# EAGLE design DC-DC Module Board Mk.2 (EAGLE 6.1)

## Sheet 1 of 4
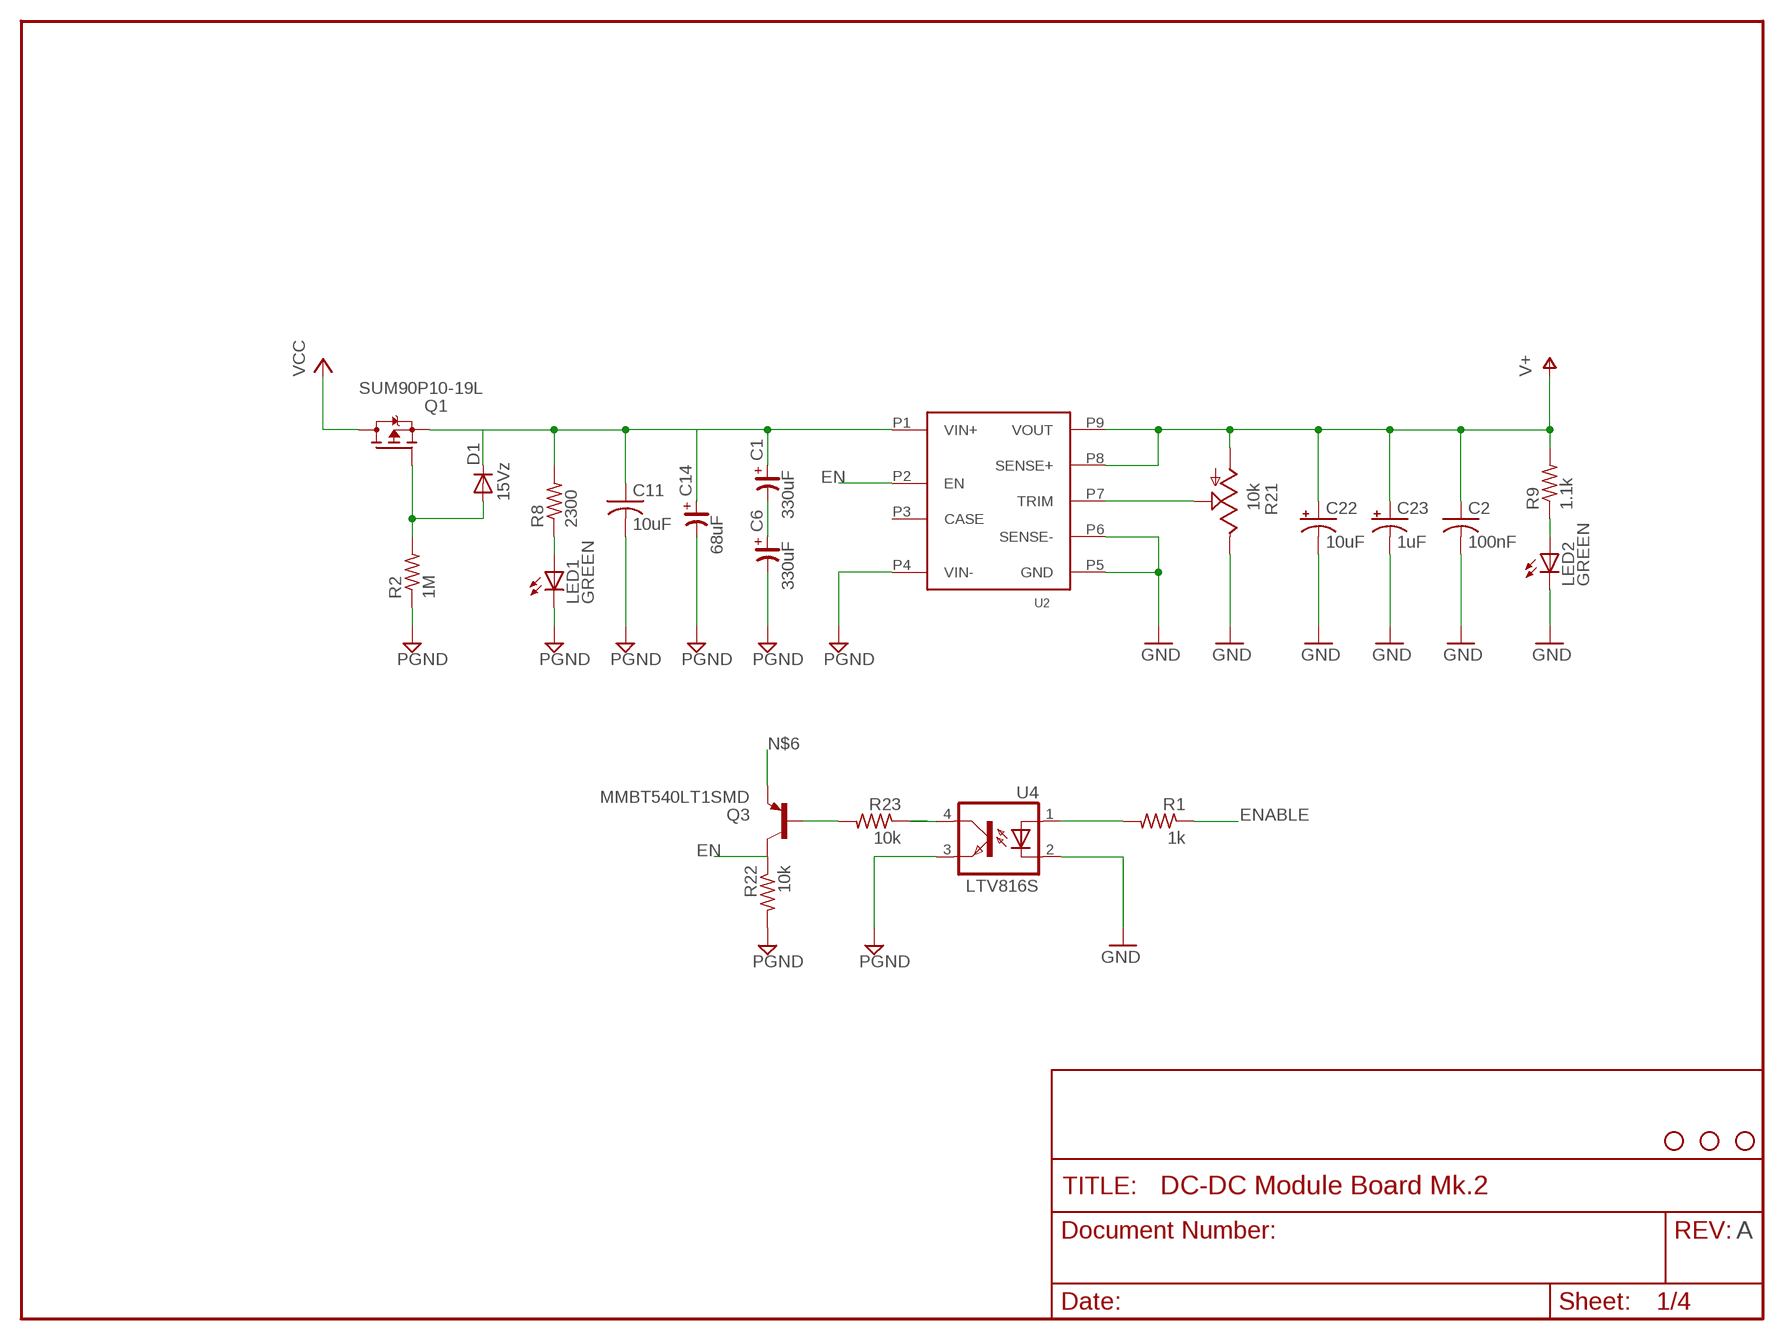
[diagram p0: schematic, sheet 1]

### Parts
C1  330uF  CP_SV-H  [CSV-H]
C2  100nF  C-USC0603  [C0603]
C6  330uF  CP_SV-H  [CSV-H]
C11  10uF  C-USC2220K  [C2220K]
C14  68uF  CP_SV-H  [CSV-H]
C22  10uF  CAP_POL7343  [EIA7343]
C23  1uF  CAP_POL3528  [EIA3528]
D1  15Vz  DIODE-SOD123  [SOD123]
JP1  STAND-OFF  [STAND-OFF]
JP2  STAND-OFF  [STAND-OFF]
JP4  STAND-OFF  [STAND-OFF]
LED1  GREEN  LED0603  [LED-0603]
LED2  GREEN  LED0603  [LED-0603]
Q1  SUM90P10-19L  SPB80P06P  [TO263]
Q3  MMBT540LT1SMD  [SOT23-BEC]
R1  1k  R-US_R0603  [R0603]
R2  1M  R-US_R0603  [R0603]
R8  2300  R-US_R2512  [R2512]
R9  1.1k  R-US_R1206  [R1206]
R21  10k  TRIM_US-SM-42/43W  [SM-42/43W]
R22  10k  R-US_R0603  [R0603]
R23  10k  R-US_R0603  [R0603]
U2  CHB350-24V  [CHB350HALFBRICK]
U4  LTV816S  [SMD4]

### Nets
EN: Q3.C R22.1 U2.P2(EN)
ENABLE: R1.1 ; also sheet 3
GND: C2.2 C22.C(-) C23.C(-) LED2.C R21.3(E) U2.P5(GND) U2.P6(SENSE-) U4.2(C) ; also sheet 2,3,4
GND1: C6.- C11.2 C14.- LED1.C R2.1 R22.2 U2.P4(VIN-) U4.3(EMIT) ; supply symbol labelled PGND ; also sheet 4
N$1: R1.2 U4.1(A)
N$4: C1.- C6.+
N$5: D1.A Q1.1(G) R2.2
N$6: C1.+ C11.1 C14.+ D1.C Q1.2(S) Q3.E R8.2 U2.P1(VIN+)
N$7: LED2.A R9.1
N$9: LED1.A R8.1
N$19: R21.2(S) U2.P7(TRIM)
N$23: R23.1 U4.4(COL)
N$24: Q3.B R23.2
V+: C2.1 C22.A(+) C23.A(+) R9.2 R21.1(A) U2.P8(SENSE+) U2.P9(VOUT) ; also sheet 2
VCC: Q1.3(D) ; also sheet 4
Unconnected: U2.P3(CASE)

### Notes on the sheet
- A

## Sheet 2 of 4
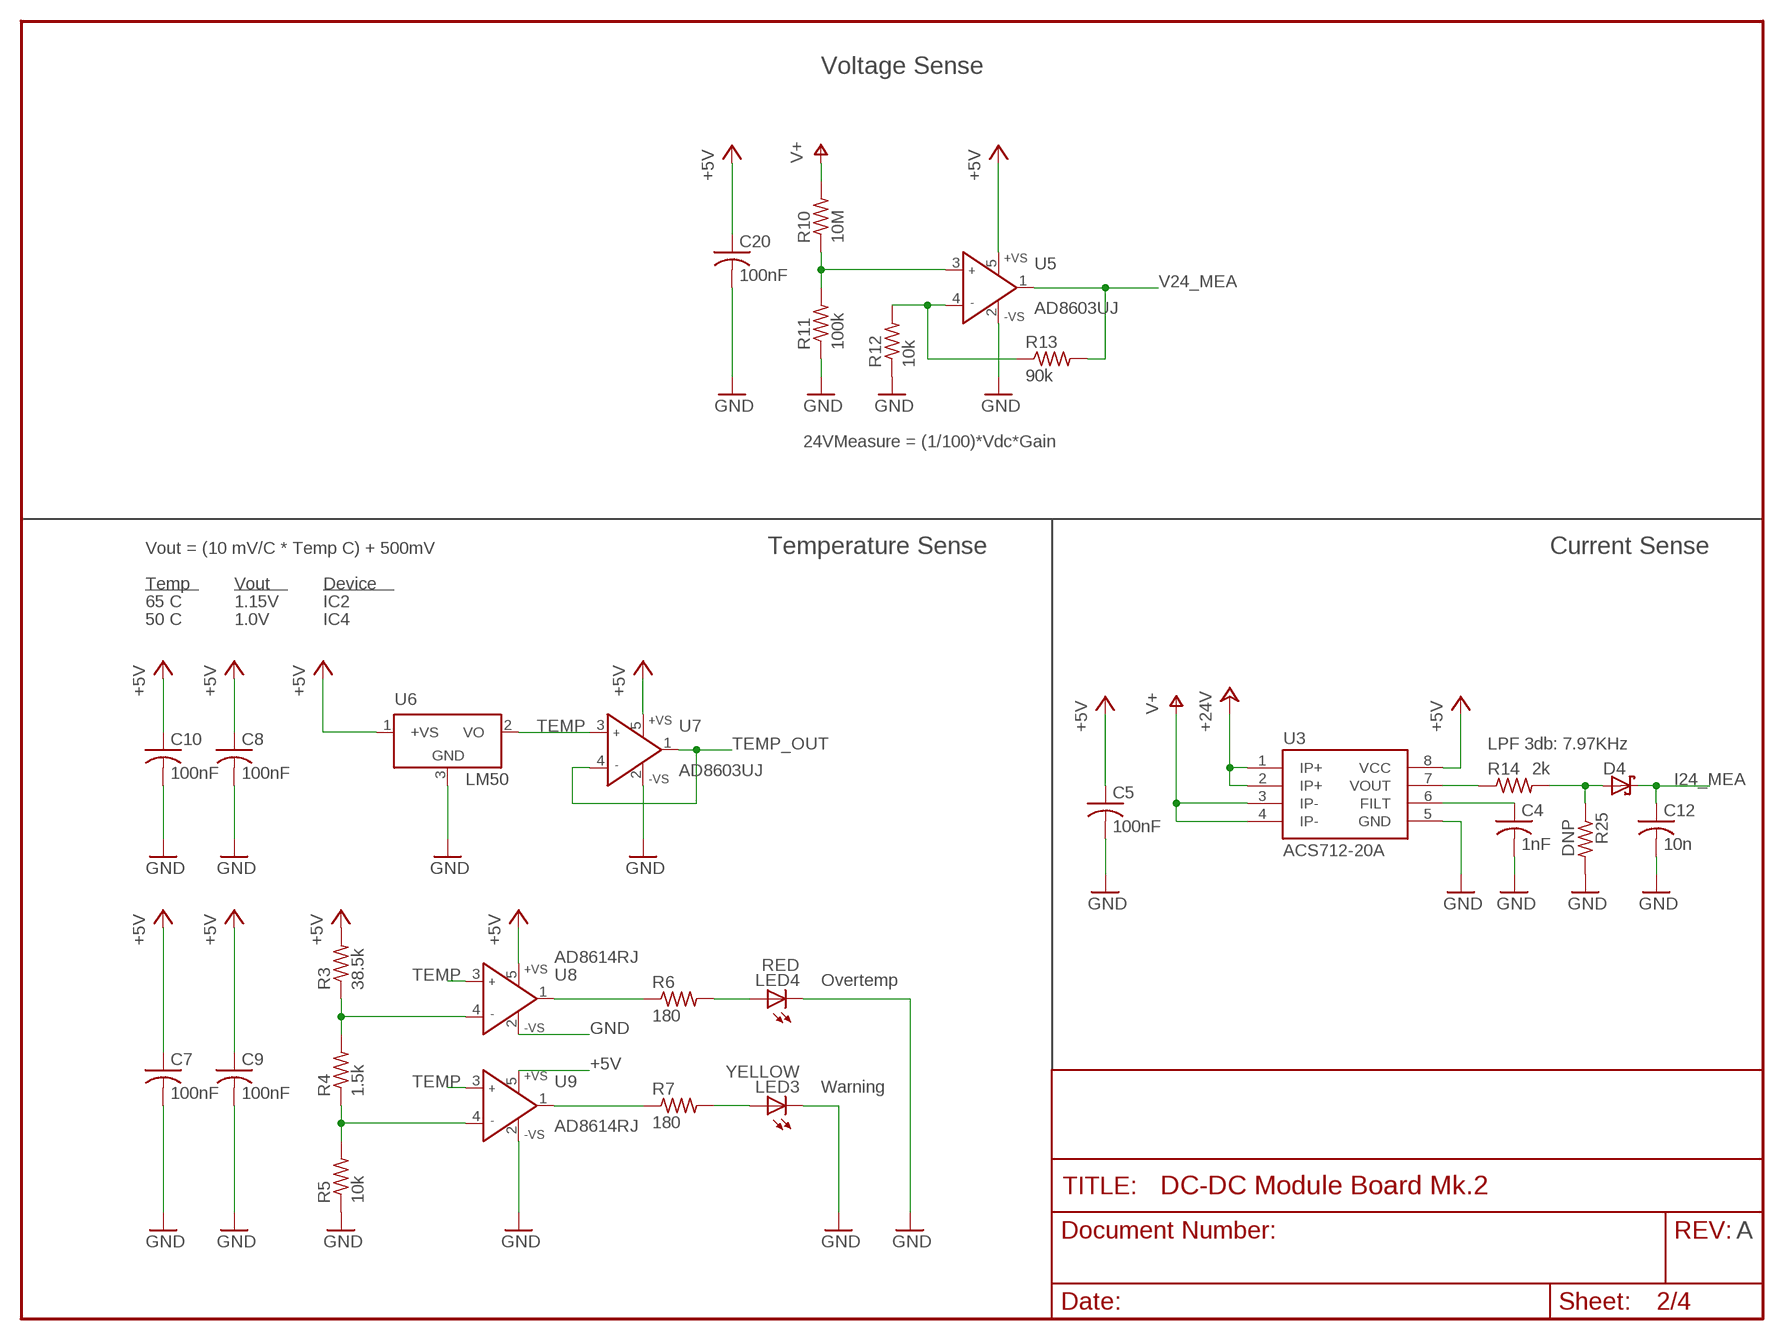
[diagram p1: schematic, sheet 2]

### Parts
C4  1nF  C-USC0603  [C0603]
C5  100nF  C-USC0603  [C0603]
C7  100nF  C-USC0603  [C0603]
C8  100nF  C-USC0603  [C0603]
C9  100nF  C-USC0603  [C0603]
C10  100nF  C-USC0603  [C0603]
C12  10n  C-USC0603  [C0603]
C20  100nF  C-USC0603  [C0603]
D4  BAT54  [SOT23]
LED3  YELLOW  LED0603  [LED-0603]
LED4  RED  LED0603  [LED-0603]
R3  38.5k  R-US_R0603  [R0603]
R4  1.5k  R-US_R0603  [R0603]
R5  10k  R-US_R0603  [R0603]
R6  180  R-US_R0603  [R0603]
R7  180  R-US_R0603  [R0603]
R10  10M  R-US_R0603  [R0603]
R11  100k  R-US_R0603  [R0603]
R12  10k  R-US_R0603  [R0603]
R13  90k  R-US_R0603  [R0603]
R14  2k  R-US_R0603  [R0603]
R25  DNP  R-US_R0603  [R0603]
U3  ACS712-20A  ACS712  [SO08]
U5  AD8603UJ  [SOT23-5]
U6  LM50  [SOT23]
U7  AD8603UJ  [SOT23-5]
U8  AD8614RJ  [SOT23-5]
U9  AD8614RJ  [SOT23-5]

### Nets
+5V: C5.1 C7.1 C8.1 C9.1 C10.1 C20.1 R3.2 U3.8(VCC) U5.5(+VS) U6.1(+VS) U7.5(+VS) U8.5(+VS) U9.5(+VS) ; also sheet 3,4
+24V: U3.1(IP+) U3.2(IP+) ; also sheet 4
GND: C4.2 C5.2 C7.2 C8.2 C9.2 C10.2 C12.2 C20.2 LED3.C LED4.C R5.1 R11.1 R12.1 R25.2 U3.5(GND) U5.2(-VS) U6.3(GND) U7.2(-VS) U8.2(-VS) U9.2(-VS) ; also sheet 1,3,4
I24_MEA: C12.1 D4.3(C) ; also sheet 3
N$2: C4.1 U3.6(FILT)
N$3: R3.1 R4.2 U8.4(IN-)
N$8: R4.1 R5.2 U9.4(IN-)
N$10: LED4.A R6.2
N$11: LED3.A R7.2
N$12: R6.1 U8.1(OUT)
N$13: R7.1 U9.1(OUT)
N$14: R12.2 R13.1 U5.4(IN-)
N$15: R10.1 R11.2 U5.3(IN+)
N$17: D4.1(A) R14.2 R25.1
N$18: R14.1 U3.7(VOUT)
TEMP: U6.2(VO) U7.3(IN+) U8.3(IN+) U9.3(IN+)
TEMP_OUT: U7.1(OUT) U7.4(IN-) ; also sheet 3
V24_MEA: R13.2 U5.1(OUT) ; also sheet 3
V+: R10.2 U3.3(IP-) U3.4(IP-) ; also sheet 1

### Notes on the sheet
- Voltage Sense
- 24VMeasure = (1/100)*Vdc*Gain
- Vout = (10 mV/C * Temp C) + 500mV | Temperature Sense | Current Sense
- Temp | Vout | Device
- 65 C | 1.15V | IC2
- 50 C | 1.0V | IC4
- LPF 3db: 7.97KHz
- Overtemp
- Warning
- A

## Sheet 3 of 4
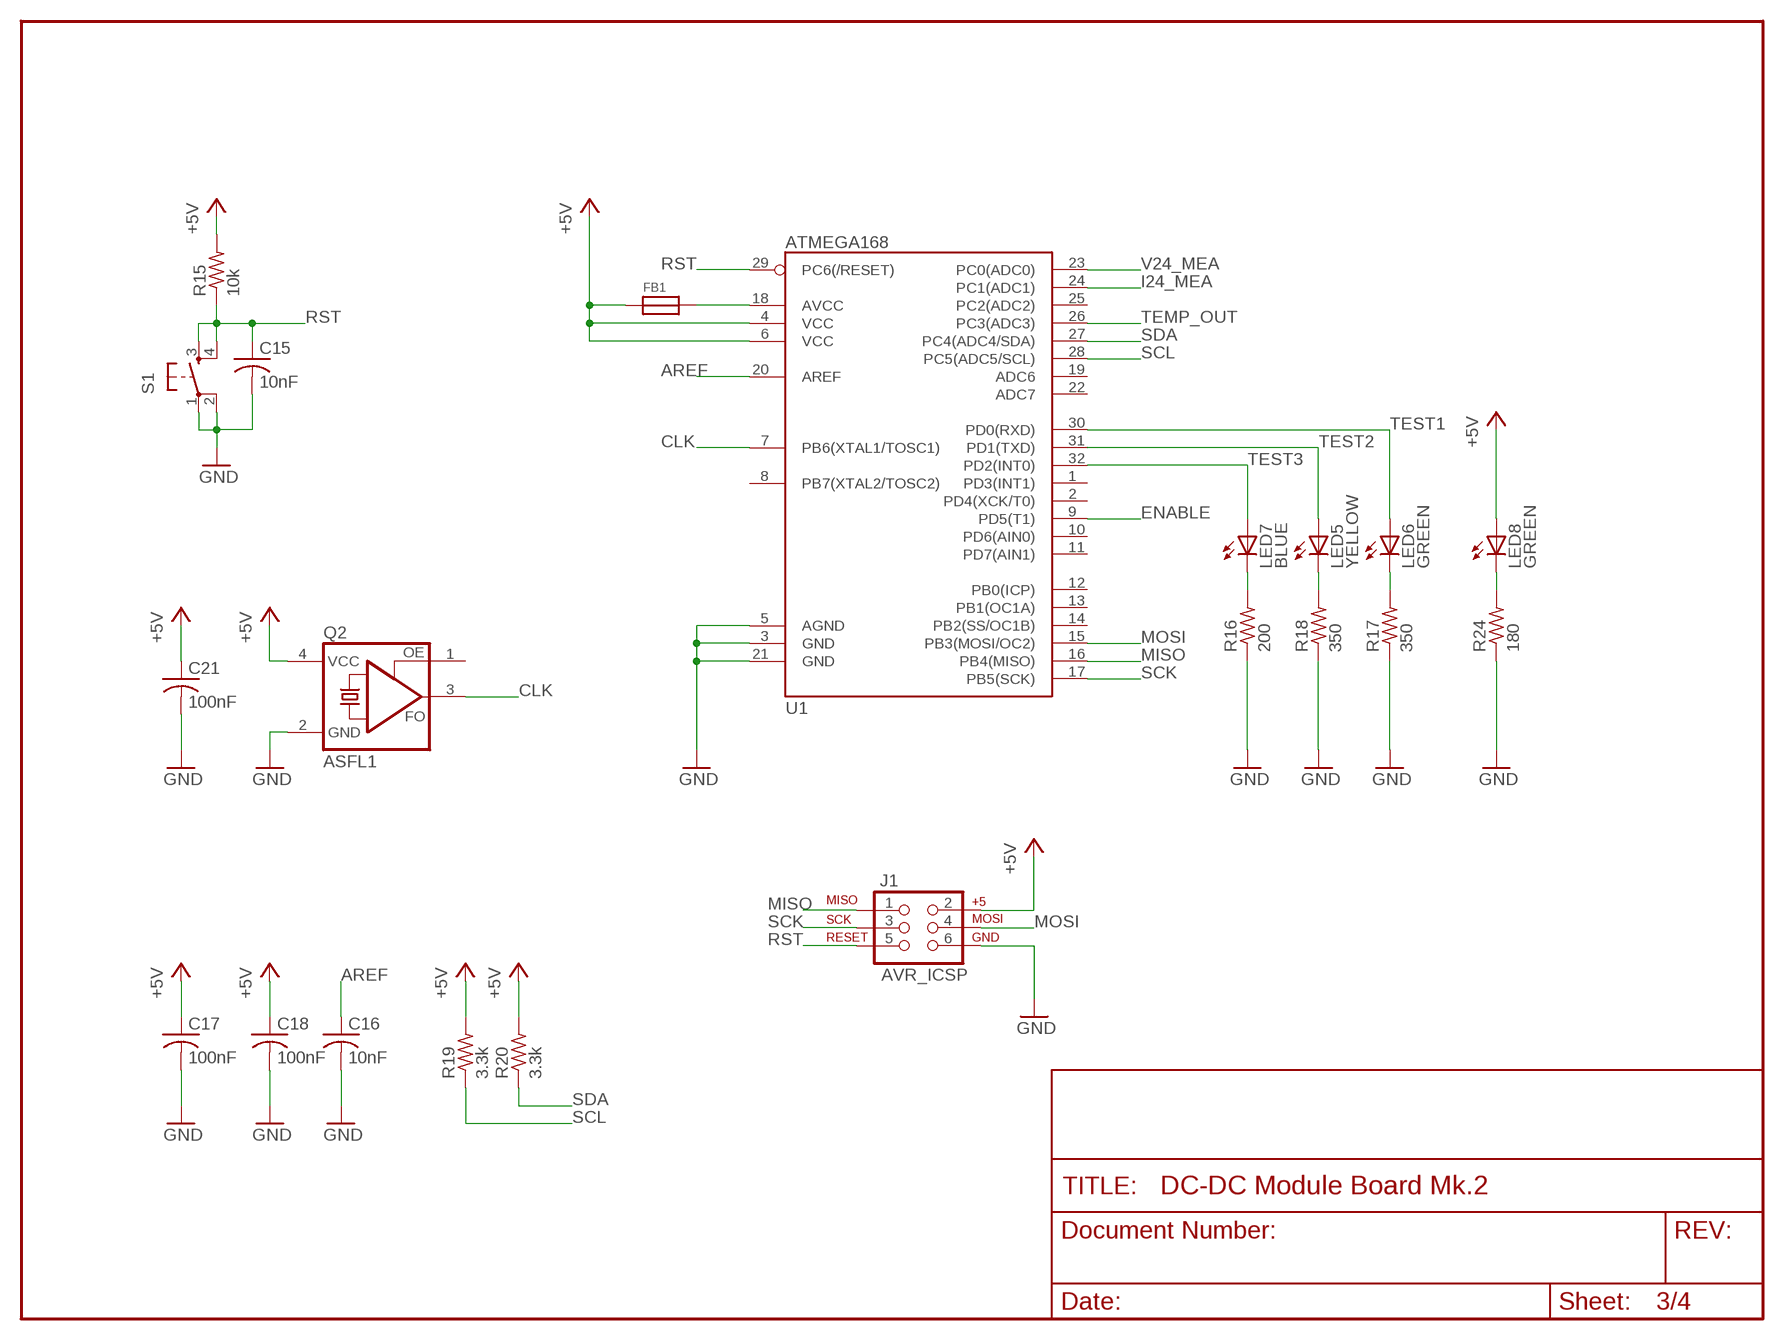
[diagram p2: schematic, sheet 3]

### Parts
C15  10nF  C-USC0603  [C0603]
C16  10nF  C-USC0603  [C0603]
C17  100nF  C-USC0603  [C0603]
C18  100nF  C-USC0603  [C0603]
C21  100nF  C-USC0603  [C0603]
FB1  FERRITE  [0603]
J1  AVR_ICSP  AVR_SPI_PRG_62X3_LOCK  [2X3_LOCK]
LED5  YELLOW  LED0603  [LED-0603]
LED6  GREEN  LED0603  [LED-0603]
LED7  BLUE  LED0603  [LED-0603]
LED8  GREEN  LED0603  [LED-0603]
Q2  ASFL1  [ASF]
R15  10k  R-US_R0603  [R0603]
R16  200  R-US_R0603  [R0603]
R17  350  R-US_R0603  [R0603]
R18  350  R-US_R0603  [R0603]
R19  3.3k  R-US_R0603  [R0603]
R20  3.3k  R-US_R0603  [R0603]
R24  180  R-US_R0603  [R0603]
S1  TAC_SWITCHSMD  [TACTILE_SWITCH_SMD]
U1  ATMEGA168  [TQFP32-08]

### Nets
+5V: C17.1 C18.1 C21.1 FB1.1 J1.2 LED8.A Q2.4(VCC) R15.2 R19.2 R20.2 U1.4(VCC) U1.6(VCC) ; also sheet 2,4
AREF: C16.1 U1.20(AREF)
CLK: Q2.3(FO) U1.7(PB6(XTAL1/TOSC1))
ENABLE: U1.9(PD5(T1)) ; also sheet 1
GND: C15.2 C16.2 C17.2 C18.2 C21.2 J1.6 Q2.2(GND) R16.1 R17.1 R18.1 R24.1 S1.1 S1.2 U1.3(GND) U1.5(AGND) U1.21(GND) ; also sheet 1,2,4
I24_MEA: U1.24(PC1(ADC1)) ; also sheet 2
MISO: J1.1 U1.16(PB4(MISO))
MOSI: J1.4 U1.15(PB3(MOSI/OC2))
N$16: FB1.2 U1.18(AVCC)
N$20: LED7.C R16.2
N$21: LED5.C R18.2
N$22: LED6.C R17.2
N$25: LED8.C R24.2
RST: C15.1 J1.5 R15.1 S1.3 S1.4 U1.29(PC6(/RESET))
SCK: J1.3 U1.17(PB5(SCK))
SCL: R19.1 U1.28(PC5(ADC5/SCL)) ; also sheet 4
SDA: R20.1 U1.27(PC4(ADC4/SDA)) ; also sheet 4
TEMP_OUT: U1.26(PC3(ADC3)) ; also sheet 2
TEST1: LED6.A U1.30(PD0(RXD))
TEST2: LED5.A U1.31(PD1(TXD))
TEST3: LED7.A U1.32(PD2(INT0))
V24_MEA: U1.23(PC0(ADC0)) ; also sheet 2
Unconnected: Q2.1(OE) U1.1(PD3(INT1)) U1.2(PD4(XCK/T0)) U1.8(PB7(XTAL2/TOSC2)) U1.10(PD6(AIN0)) U1.11(PD7(AIN1)) U1.12(PB0(ICP)) U1.13(PB1(OC1A)) U1.14(PB2(SS/OC1B)) U1.19(ADC6) U1.22(ADC7) U1.25(PC2(ADC2))

### Notes on the sheet
- C:/Users/Clayton Kleppinger/Dropbox/IEEE ROV 2012/Electronics/DC-DC Module Board/purdue-logo.bmp

## Sheet 4 of 4
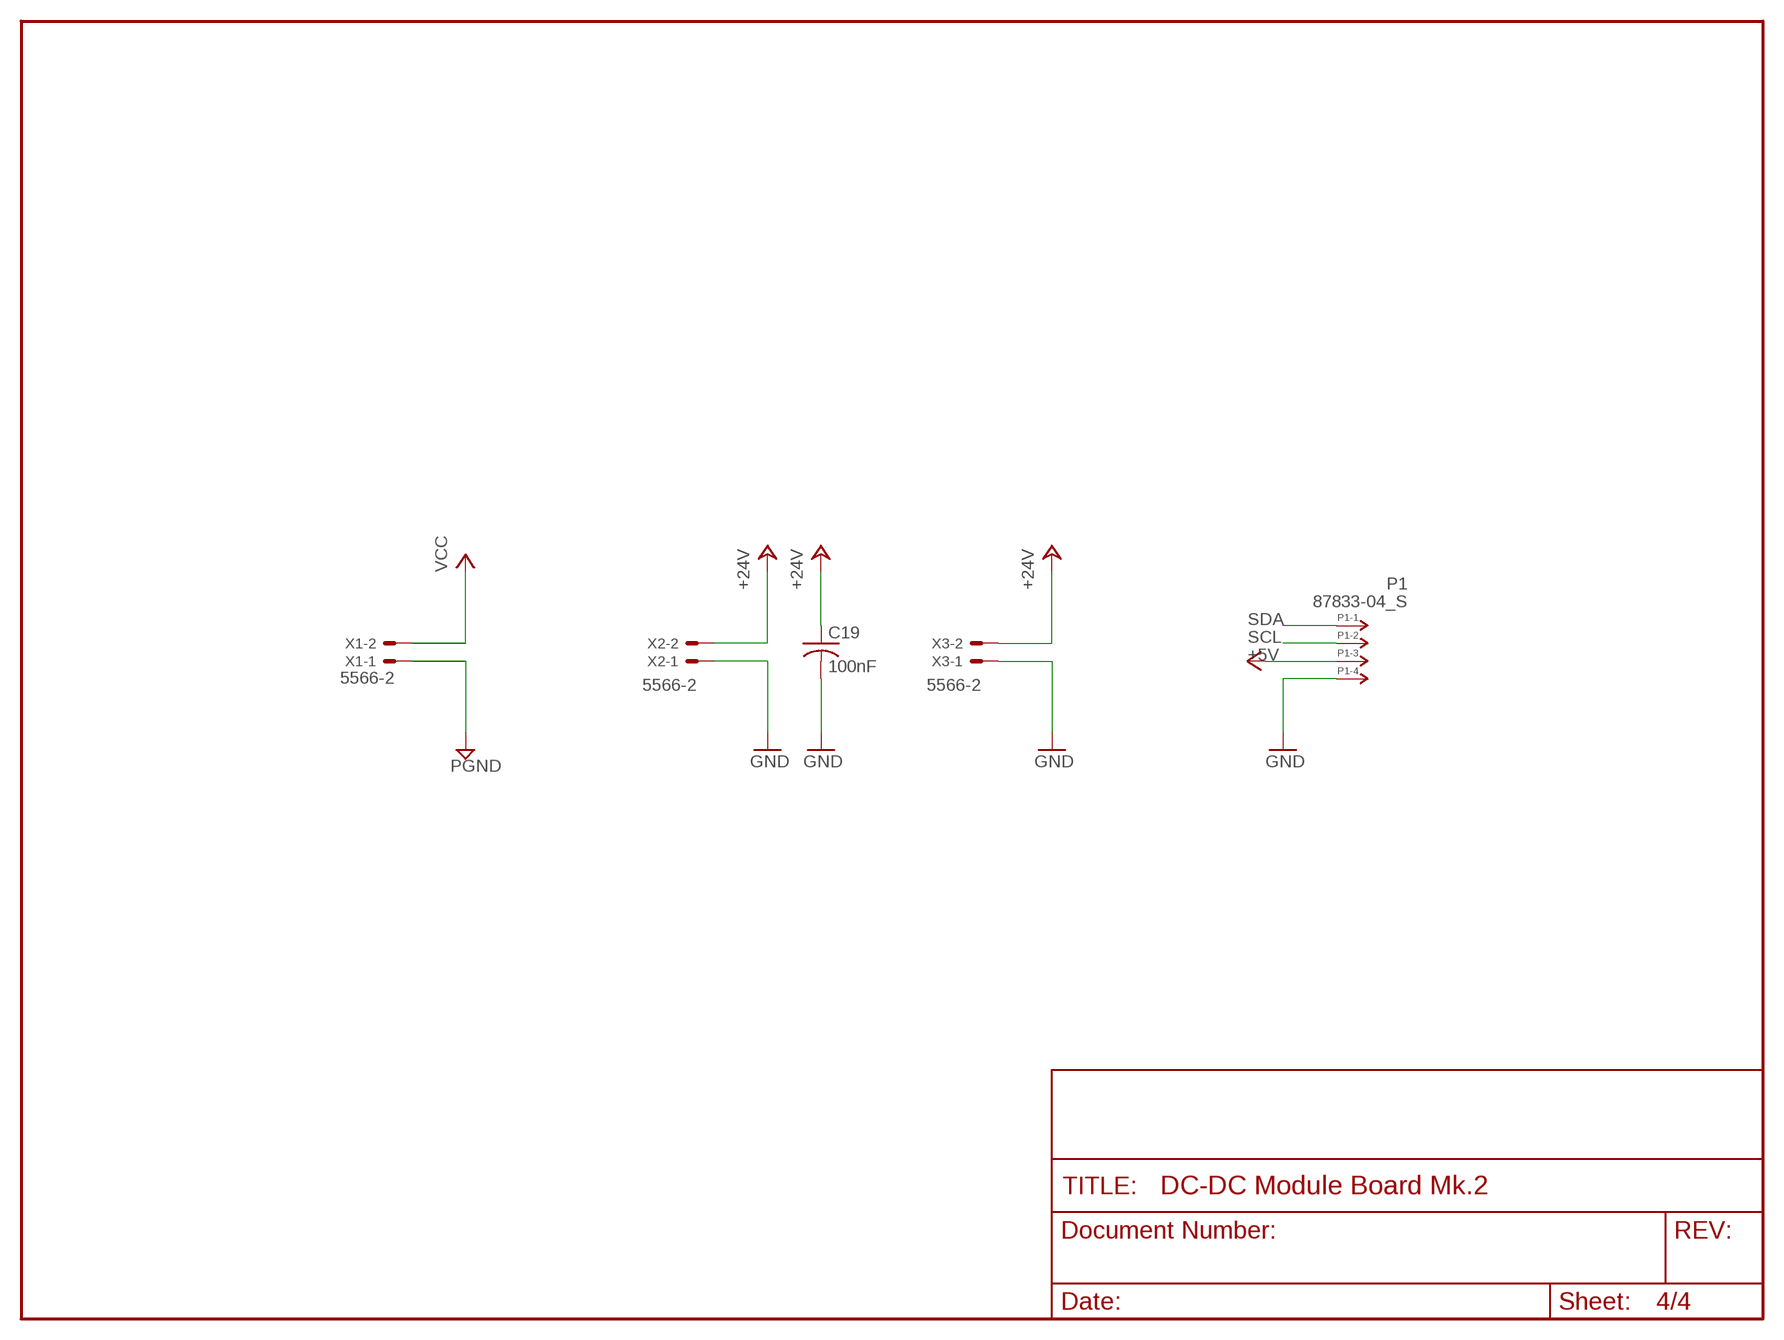
[diagram p3: schematic, sheet 4]

### Parts
C19  100nF  C-USC0603  [C0603]
P1  87833-04_S  [87833-04]
X1  5566-2  [5566-2]
X2  5566-2  [5566-2]
X3  5566-2  [5566-2]

### Nets
+5V: P1.3 ; also sheet 2,3
+24V: C19.1 X2.2 X3.2 ; also sheet 2
GND: C19.2 P1.4 X2.1 X3.1 ; also sheet 1,2,3
GND1: X1.1 ; supply symbol labelled PGND ; also sheet 1
SCL: P1.2 ; also sheet 3
SDA: P1.1 ; also sheet 3
VCC: X1.2 ; also sheet 1

## Library data of the parts
C1 C6 = rc-master:CP_: POLARIZED CAP; BOM: INCLUDE; PARTNO: 338-2190-1-ND
C2 C5 C7-C10 C17-C20 = resistor:C-US: CAPACITOR, American symbol; BOM: INCLUDE; PARTNO: 445-5202-1-ND
C4 = resistor:C-US: CAPACITOR, American symbol; BOM: INCLUDE; PARTNO: 490-1472-1-ND
C11 = resistor:C-US: CAPACITOR, American symbol; BOM: INCLUDE; PARTNO: 445-5212-1-ND
C12 C15 C16 = resistor:C-US: CAPACITOR, American symbol; BOM: INCLUDE; PARTNO: 445-1304-1-ND
C14 = rc-master:CP_: POLARIZED CAP; BOM: INCLUDE; PARTNO: 565-2343-1-ND
C21 = resistor:C-US: CAPACITOR, American symbol; BOM: INCLUDE; PARTNO: 445-5047-1-ND
C22 = SparkFun:CAP_POL: Capacitor Polarized These are standard SMD and PTH capacitors. Normally 10uF, 47uF, and 100uF in electrolytic and tantalum varieties. Always verify the external diameter of the through hole cap, it varies with capacity, voltage, and manufacturer. The EIA devices should be standard.; BOM: INCLUDE; PARTNO: 399-3893-1-ND
C23 = SparkFun:CAP_POL: Capacitor Polarized These are standard SMD and PTH capacitors. Normally 10uF, 47uF, and 100uF in electrolytic and tantalum varieties. Always verify the external diameter of the through hole cap, it varies with capacity, voltage, and manufacturer. The EIA devices should be standard.; BOM: INCLUDE; PARTNO: 478-6247-1-ND
D1 = diode:DIODE-: DIODE; BOM: INCLUDE; PARTNO: MMSZ5245BFSCT-ND
D4 = diode:BAT54: Schottky Diodes Source: Fairchild .. BAT54.pdf; BOM: INCLUDE; PARTNO: BAT54FSCT-ND
FB1 = microbuilder:FERRITE: Ferrite Bead 0603 MMZ1608B121C - 120 Ohm, 600mA Ferrite Chip - Digikey: 445-2164-1-ND BK1608HW121-T - 120 Ohm, 600mA Ferrite Chip - Digikey: 587-1876-2-ND; BOM: INCLUDE; PARTNO: 445-2164-1-ND
J1 = SparkFun:AVR_SPI_PRG_6: AVR ISP 6 Pin This is the reduced ISP connector for AVR programming. Common on Arduino. This footprint will take up less PCB space and can be used with a 10-pin to 6-pin adapter such as SKU: BOB-08508
JP1 JP2 JP4 = SparkFun:STAND-OFF: Stand Off This is the mechanical footprint for a #4 phillips button head screw. Use the keepout ring to avoid running the screw head into surrounding components. SKU : PRT-00447
LED1 LED2 LED6 LED8 = SparkFun:LED: LEDs Standard schematic elements and footprints for 5mm, 3mm, 1206, and 0603 sized LEDs. 5mm - Spark Fun Electronics SKU : COM-00529 (and others); BOM: INCLUDE; PARTNO: 160-1446-1-ND
LED3 = SparkFun:LED: LEDs Standard schematic elements and footprints for 5mm, 3mm, 1206, and 0603 sized LEDs. 5mm - Spark Fun Electronics SKU : COM-00529 (and others); BOM: INCLUDE; PARTNO: 160-1447-1-ND
LED4 LED5 = SparkFun:LED: LEDs Standard schematic elements and footprints for 5mm, 3mm, 1206, and 0603 sized LEDs. 5mm - Spark Fun Electronics SKU : COM-00529 (and others); BOM: INCLUDE; PARTNO: 160-1448-1-ND
LED7 = SparkFun:LED: LEDs Standard schematic elements and footprints for 5mm, 3mm, 1206, and 0603 sized LEDs. 5mm - Spark Fun Electronics SKU : COM-00529 (and others); BOM: INCLUDE; PARTNO: 160-1647-1-ND
P1 = con-molex-milli-grid:87833-04_S: HEADER; BOM: INCLUDE; PARTNO: WM18858-ND
Q1 = transistor-fet:SPB80P06P: SIPMOS (R) Power-Transistor P-Channel, Enhancement mode Source: http://www.infineon.com/upload/Document/cmc_upload/documents/011/3685/SPP80P06P.pdf; BOM: INCLUDE; PARTNO: SUM90P10-19L-E3CT-ND
Q2 = crystal:ASF*: CRYSTAL CLOCK OSCILLATORS 5.0 Vdc or 3.3 Vdc - LOW PROFILE ULTRA MINIATURE CERAMIC SURFACE MOUNT Source: http://www.abracon.com/Oscillators/asf1-L-L1.pdf; BOM: INCLUDE; MF: Abracon Corporation; MPN: ASFL1-125.000MHZ-EC-T; OC_FARNELL: 1838931; OC_NEWARK: 19M1882; PARTNO: XC1900CT-ND
Q3 = transistor-pnp:MMBT540*: PNP Transistror; BOM: INCLUDE; PARTNO: MMBT5401FSCT-ND
R1 = resistor:R-US_: RESISTOR, American symbol; BOM: INCLUDE; PARTNO: P1.00KHCT-ND
R2 = resistor:R-US_: RESISTOR, American symbol; BOM: INCLUDE; PARTNO: 1.00MHCT-ND
R3 = resistor:R-US_: RESISTOR, American symbol; BOM: INCLUDE; PARTNO: P33.2KHCT-ND
R4 = resistor:R-US_: RESISTOR, American symbol; BOM: INCLUDE; PARTNO: P2.70KHCT-ND
R5 R12 R15 R22 R23 = resistor:R-US_: RESISTOR, American symbol; BOM: INCLUDE; PARTNO: P10.0KHCT-ND
R6 R7 = resistor:R-US_: RESISTOR, American symbol; BOM: INCLUDE; PARTNO: P82.0HCT-ND
R8 = resistor:R-US_: RESISTOR, American symbol; BOM: INCLUDE; PARTNO: RHC2512FT2K20CT-ND
R9 = resistor:R-US_: RESISTOR, American symbol; BOM: INCLUDE; PARTNO: RNCP1206FTD1K10CT-ND
R10 = resistor:R-US_: RESISTOR, American symbol; BOM: INCLUDE; PARTNO: P10MGCT-ND
R11 = resistor:R-US_: RESISTOR, American symbol; BOM: INCLUDE; PARTNO: P100KHCT-ND
R13 = resistor:R-US_: RESISTOR, American symbol; BOM: INCLUDE; PARTNO: P90.9KHCT-ND
R14 R25 = resistor:R-US_: RESISTOR, American symbol; BOM: INCLUDE; PARTNO: P2.00KHCT-ND
R16 = resistor:R-US_: RESISTOR, American symbol; BOM: INCLUDE; PARTNO: P200HCT-ND
R17 R18 = resistor:R-US_: RESISTOR, American symbol; BOM: INCLUDE; PARTNO: P340HCT-ND
R19 R20 = resistor:R-US_: RESISTOR, American symbol; BOM: INCLUDE; PARTNO: P33.0KHCT-ND
R21 = pot:TRIM_US-: POTENTIOMETER; BOM: INCLUDE; PARTNO: SM-43TW103CT-ND
R24 = resistor:R-US_: RESISTOR, American symbol; BOM: INCLUDE; PARTNO: P180HCT-ND
S1 = SparkFun:TAC_SWITCH: Momentary Switch Button commonly used for reset or general input. Spark Fun Electronics SKU : COM-00097; BOM: INCLUDE; PARTNO: COM-08720
U1 = SparkFun:ATMEGA168; BOM: INCLUDE; PARTNO: ATMEGA168-20AU-ND
U2 = Custom_Components:CHB350-24V
U3 = SparkFun:ACS712; BOM: INCLUDE; PARTNO: 620-1190-1-ND
U4 = optocoupler:LTV816: OPTO COUPLER Source: LITEON, LTV816.pdf; BOM: INCLUDE; OC_FARNELL: unknown; OC_NEWARK: unknown; PARTNO: 160-1361-5-ND
U5 U7 = analog-devices:AD8603: Precision Micropower, Low Noise CMOS, Rail-to-Rail Input/Output Operational Amplifiers Source: http://www.analog.com/static/imported-files/data_sheets/AD8603_8607_8609.pdf; BOM: INCLUDE; MF: ALTERA CORPORATION; MPN: AD8603AUJZ-REEL7; OC_FARNELL: 1651290; OC_NEWARK: 59K6904; PARTNO: AD8603AUJZREEL7CT-ND
U6 = linear:LM50: SOT-23 Single-Supply Centigrade Temperature Sensor Vout = (10mV/°C x Temp °C) +5mmmV Source: http://cache.national.com/ds/LM/LM50.pdf; BOM: INCLUDE; PARTNO: LM50CIM3CT-ND
U8 U9 = analog-devices:AD8614: Single and Quad 18 V Operational Amplifiers Source: http://www.analog.com/static/imported-files/data_sheets/AD8614_8644.pdf; BOM: INCLUDE; MF: ALTERA CORPORATION; MPN: AD8614ARTZ-REEL7; OC_FARNELL: 1464998; OC_NEWARK: 88H0303; PARTNO: AD8614ARTZ-REEL7CT-ND
X1-X3 = con-molex:5566-2: Mini FIT connector 2 pol Source: http://www.molex.com; BOM: INCLUDE; OC_FARNELL: 1822072; OC_NEWARK: unknown; PARTNO: WM23800-ND

## Board
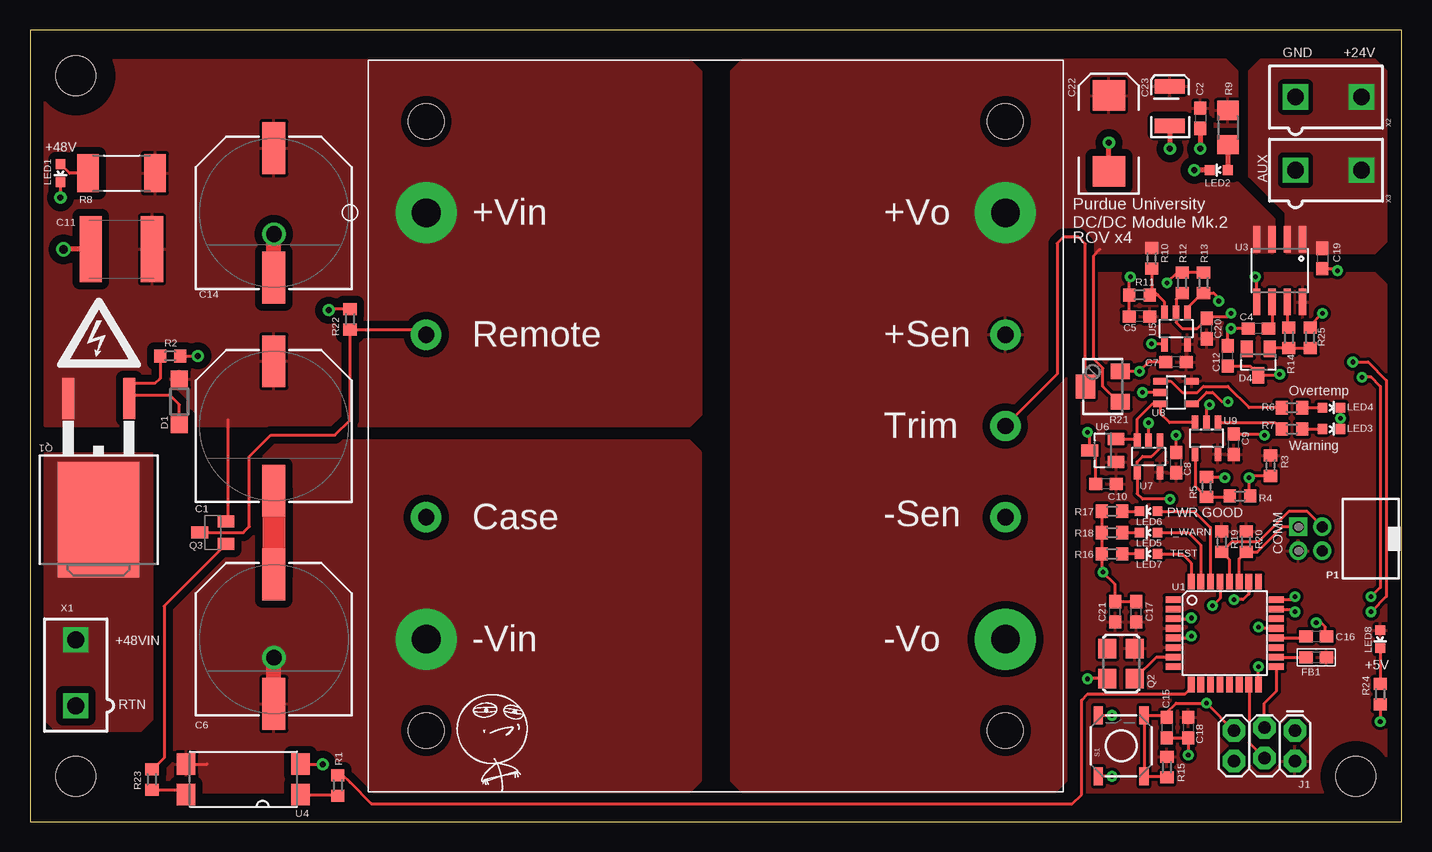
[diagram p4: board, top side]
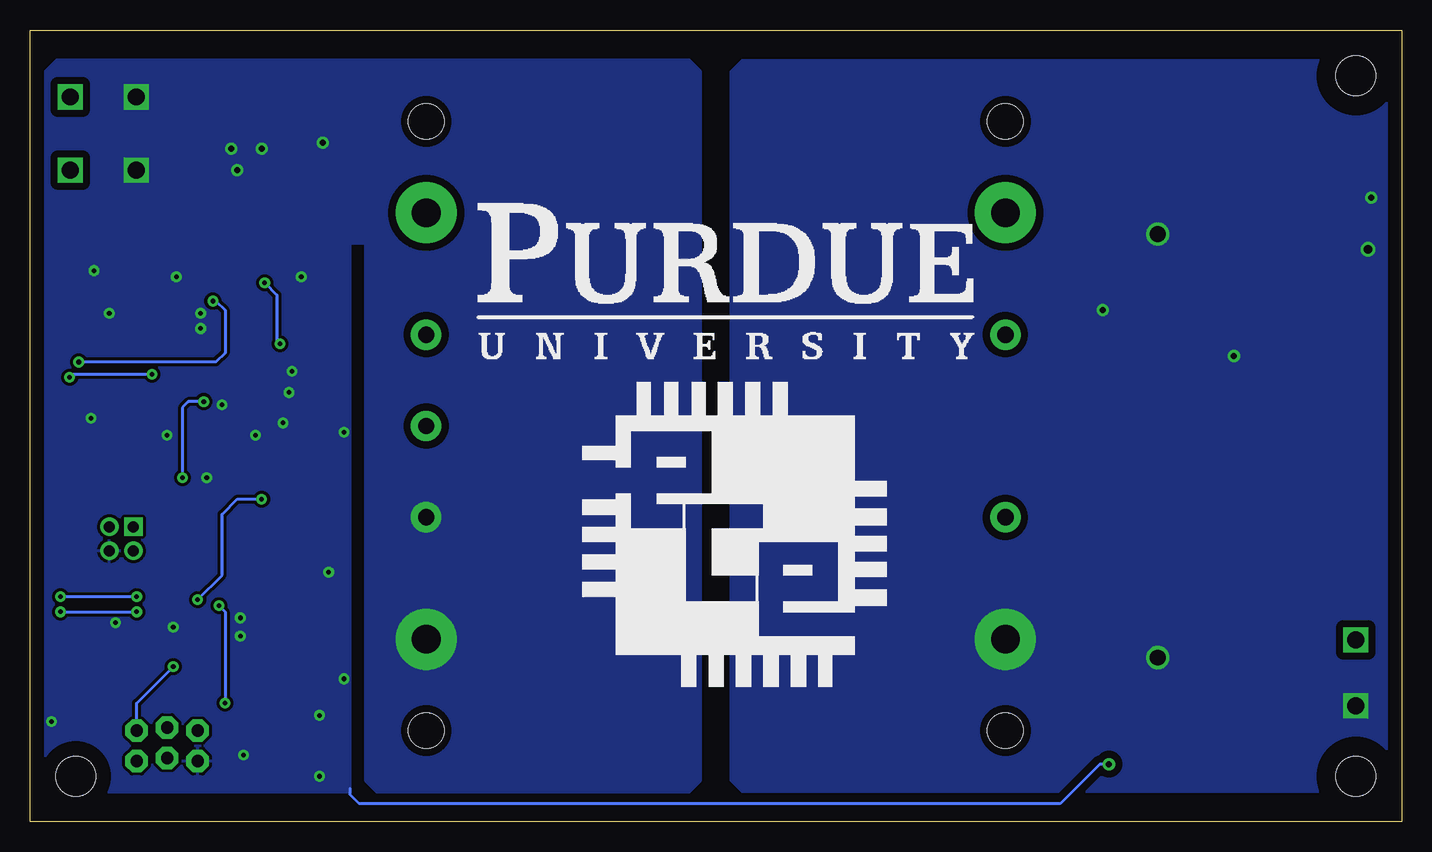
[diagram p5: board, bottom side, seen from below]

Size 114.3 x 66.04 mm. Coordinates in mm from the lower left corner, seen from the top.
Outline: 0,0 114.3,0 114.3,66.04 0,66.04 0,0
Copper layers (1*16): Top 0.035mm / dielectric 1.5mm / Bottom 0.035mm
Design rules: minimum track width 8mil, minimum drill 20mil, track to track 8mil, track to pad 8mil, pad to pad 8mil, via to via 8mil, smd to smd 8mil, copper to edge 10mil, drill to drill 8mil, minimum pad ring 12mil, minimum via ring 10mil, stop-mask expansion 4mil, vias tented up to drill 25mil, thermal gap 10mil
tRestrict: area 1.3,1.3 to 6.3,6.3; area 1.3,59.7 to 6.3,64.8; area 107.9,1.3 to 113,6.3
bRestrict: area 1.3,1.3 to 6.3,6.3; area 1.3,59.7 to 6.3,64.8; area 107.9,1.3 to 113,6.3

### Footprints (pad centres in the part's own frame; a part is rotated, then mirrored left to right if it is on the bottom)
CSV-H = smd 4.318 x 1.93: + -5.397,0; - 5.397,0
C0603 = smd 1.1 x 1: 1 -0.85,0; 2 0.85,0
C2220K = smd 1.85 x 5.5: 1 -2.55,0; 2 2.55,0
EIA7343 = smd 2.55 x 2.7: A 3.17,0; C -3.17,0
EIA3528 = smd 1.2 x 2.5: A 1.65,0; C -1.65,0
SOD123 = smd 1.4 x 1.4: A 1.9,0; C -1.9,0
SOT23 = smd 1 x 1.4: 1 -0.95,-1.1; 2 0.95,-1.1; 3 0,1.1
0603 = smd 1.1 x 1: 1 -0.85,0; 2 0.85,0
2X3_LOCK = drill 1.016 pad 1.88 octagon: 1 0,0; 2 0,2.54; 3 2.54,-0.254; 4 2.54,2.286; 5 5.08,0; 6 5.08,2.54
STAND-OFF = hole 3.302: 0,0
LED-0603 = smd 0.8 x 0.8: A 0,-0.75; C 0,0.75
87833-04 = drill 0.914 square: 1 -1,-1 | drill 0.914: 2 -1,1; 3 1,-1; 4 1,1
TO263 = smd 1 x 3.4: 1 -2.54,-6.6; 2 2.54,-6.6 | smd 6.8 x 9.6: 3 0,3.5
ASF = smd 1.6 x 1.5: 1 -1.25,-1.15; 2 1.25,-1.15; 3 1.25,1.15; 4 -1.25,1.15
SOT23-BEC = smd 1 x 1.4: B -0.95,-1.1; C 0,1.1; E 0.95,-1.1
R0603 = smd 1 x 1.1: 1 -0.85,0; 2 0.85,0
R2512 = smd 1.8 x 3.2: 1 -2.8,0; 2 2.8,0
R1206 = smd 1.6 x 1.803: 1 -1.422,0; 2 1.422,0
SM-42/43W = smd 1.3 x 1.6: 1 -1.27,-1.45; 3 1.27,-1.45 | smd 2 x 1.6: 2 0,1.45
TACTILE_SWITCH_SMD = smd 1.524 x 0.762: 1 -2.54,1.905; 2 2.54,1.905; 3 -2.54,-1.905; 4 2.54,-1.905
TQFP32-08 = smd 1.27 x 0.559: 1 -4.293,2.8; 2 -4.293,2; 3 -4.293,1.2; 4 -4.293,0.4; 5 -4.293,-0.4; 6 -4.293,-1.2; 7 -4.293,-2; 8 -4.293,-2.8; 17 4.293,-2.8; 18 4.293,-2; 19 4.293,-1.2; 20 4.293,-0.4; 21 4.293,0.4; 22 4.293,1.2; 23 4.293,2; 24 4.293,2.8 | smd 0.559 x 1.27: 9 -2.8,-4.293; 10 -2,-4.293; 11 -1.2,-4.293; 12 -0.4,-4.293; 13 0.4,-4.293; 14 1.2,-4.293; 15 2,-4.293; 16 2.8,-4.293; 25 2.8,4.293; 26 2,4.293; 27 1.2,4.293; 28 0.4,4.293; 29 -0.4,4.293; 30 -1.2,4.293; 31 -2,4.293; 32 -2.8,4.293
CHB350HALFBRICK = drill 2.388 pad 5.08: P1 -24.13,17.78; P4 -24.13,-17.78; P5 24.13,-17.78; P9 24.13,17.78 | drill 1.372 pad 2.54: P2 -24.13,7.62; P3 -24.13,-7.62; P6 24.13,-7.62; P7 24.13,0; P8 24.13,7.62 | hole 2.972: -24.13,-25.4; -24.13,25.4; 24.13,25.4; 24.13,-25.4
SO08 = smd 0.61 x 2.21: 1 -1.905,-2.616; 2 -0.635,-2.616; 3 0.635,-2.616; 4 1.905,-2.616; 5 1.905,2.616; 6 0.635,2.616; 7 -0.635,2.616; 8 -1.905,2.616
SMD4 = smd 1.78 x 1.55: 1 -1.27,-4.77; 2 1.27,-4.77; 3 1.27,4.77; 4 -1.27,4.77
SOT23-5 = smd 0.55 x 1.2: 1 -0.95,-1.3; 2 0,-1.3; 3 0.95,-1.3; 4 0.95,1.3; 5 -0.95,1.3
5566-2 = drill 1.4 square: 1 0,-2.75; 2 0,2.75

### Placement (x,y rotation side)
C1  20.32,33.02 270 top
C2  97.54,58.67 270 top
C4  102.36,41.15 180 top
C5  92.46,42.16 180 top
C6  20.32,15.24 270 top
C7  95.5,38.35 180 top
C8  95.5,29.97 90 top
C9  100.33,31.5 90 top
C10  89.66,28.19 180 top
C11  7.62,47.75 180 top
C12  99.82,38.86 90 top
C14  20.32,50.8 270 top
C15  94.74,7.87 270 top
C16  107.19,15.49 0 top
C17  92.2,17.53 90 top
C18  96.52,7.87 270 top
C19  107.7,46.99 270 top
C20  98.04,41.15 90 top
C21  90.42,17.53 90 top
C22  89.92,57.4 90 top
C23  95,59.69 90 top
D1  12.45,35.05 270 top
D4  102.36,38.35 180 top
FB1  107.19,13.72 180 top
J1  105.41,7.62 180 top
JP1  3.81,3.81 0 top
JP2  3.81,62.23 0 top
JP4  110.49,3.81 180 top
LED1  2.54,54.1 180 top
LED2  99.06,54.36 90 top
LED3  108.46,32.77 270 top
LED4  108.46,34.54 270 top
LED5  93.22,24.13 90 top
LED6  93.22,25.91 90 top
LED7  93.22,22.35 90 top
LED8  112.52,15.24 180 top
P1  106.68,23.62 270 top
Q1  5.71,28.7 180 top
Q2  90.93,13.21 270 top
Q3  15.24,24.13 90 top
R1  25.65,3.05 270 top
R2  11.68,38.86 180 top
R3  103.38,29.72 90 top
R4  100.84,27.18 0 top
R5  98.04,27.94 270 top
R6  105.16,34.54 0 top
R7  105.16,32.77 0 top
R8  7.62,54.1 0 top
R9  99.82,57.91 90 top
R10  93.47,46.99 90 top
R11  92.46,43.94 0 top
R12  96.01,44.96 90 top
R13  97.79,44.96 270 top
R14  104.9,40.39 270 top
R15  94.74,4.57 90 top
R16  90.17,22.35 0 top
R17  90.17,25.91 0 top
R18  90.17,24.13 0 top
R19  99.31,23.37 90 top
R20  101.35,23.37 90 top
R21  89.41,36.32 90 top
R22  26.67,41.91 90 top
R23  10.16,3.56 90 top
R24  112.52,10.67 90 top
R25  106.68,40.39 90 top
S1  90.93,6.35 90 top
U1  99.57,15.75 0 top
U2  57.15,33.02 0 top
U3  104.14,45.97 180 top
U4  17.78,3.56 90 top
U5  95.5,41.15 180 top
U6  89.41,30.99 90 top
U7  93.22,30.48 180 top
U8  95.5,35.81 270 top
U9  98.04,32 180 top
X1  3.81,12.45 0 top
X2  108.2,60.45 270 top
X3  108.2,54.36 270 top

### Tracks (layer width: path | path; a pad name or v marks a point on that pad's centre or on a via)
+5V
  pour Top (isolate 0.254): 113.03,2.54 113.03,44.8 112.11,45.72 87.63,45.72 87.63,2.54
+24V
  pour Top (isolate 0.406, no thermals): 104.65,47.5 112.11,47.5 113.03,48.41 113.03,62.58 112.11,63.5 102.52,63.5 101.6,62.58 101.6,53.85 104.65,50.8
AREF
  Top 0.254: U1.20 106.19,15.35 C16.1
CLK
  Top 0.254: U1.7 93.87,13.75 Q2.3
EN
  Top 0.254: Q3.C 17.78,24.13 18.29,24.64 18.29,30.48 20.07,32.26 25.4,32.26 26.67,33.53 R22.1 32.6,41.06 U2.P2
ENABLE
  Top 0.25: 26.67,3.3 26.07,3.9 R1.1
  Top 0.254: 26.67,3.3 28.45,1.52 86.87,1.52 87.63,2.29 87.63,10.16 88.14,10.67 96.27,10.67 96.77,11.18 96.77,11.44 U1.9
GND  (via drill 0.38, 0.5)
  Top 0.254: C4.2 v100.08,41.15 99.82,40.89 C12.2 | 101.73,41.39 C4.2 | U4.2 v24.38,4.83 | R12.1 95.5,43.6 U5.2 95.5,41.66 96.01,41.15 97.28,41.15 98.04,41.91 C20.2 98.19,42.16 99.82,42.16 v100.08,42.42 | 101.22,41.44 C4.2 | 107.7,46.23 C19.2 108.8,46.14 v108.97,45.97 | U1.21 102.47,16.15 v102.36,16.26 | U1.3 96.7,16.95 v96.77,17.02 | U1.5 96.63,15.35 v96.77,15.49 | v90.17,3.81 S1.1 | U3.5 102.23,45.34 v102.11,45.47 | R21.3 v92.46,37.59 93.22,38.35 C7.2 | R25.2 106.68,41.4 v107.7,42.42 | v88.14,32.51 88.31,32.34 U6.3 88.65,30.99 88.81,30.82 C10.2 | S1.2 v90.17,8.89 | C15.2 C18.2 v96.52,5.59 | v89.42,20.84 v89.41,20.83 | R17.1 R18.1 R16.1 89.32,20.92 v89.41,20.83 | U7.2 v93.22,33.27 | C5.2 R11.1 91.61,45.38 v91.69,45.47 | C8.2 v95.5,32.26 | U8.2 v92.71,35.81 | R5.1 99.48,28.79 v99.57,28.7 | U9.2 98.04,34.54 v98.3,34.8 | C9.2 102.78,32.35 v102.87,32.26 | LED4.C 109.21,33.67 v109.22,33.66 109.21,33.64 LED3.C | R24.1 v112.52,8.38 | 107.95,15.49 C16.2 108.08,15.53 108.08,15.75 107.95,15.88 107.95,16.26 107.57,16.64 v107.19,16.64 | Q2.2 88.16,11.96 v88.14,11.94 | v89.41,20.83 90.42,19.81 C21.2 C17.2
  Top 0.406: C22.C v89.92,56.64 | C23.C v95,56.13 | C2.2 v97.54,56.13 | LED2.C v97.03,54.36
  Bottom 0.25: 24.64,4.83 25.15,4.83 25.65,4.32
  Bottom 0.254: v24.38,4.83 24.64,4.83 | 25.65,4.32 28.45,1.52 86.87,1.52 87.63,2.29 87.63,2.79
  pour Bottom (isolate 0.61, no thermals): 86.36,48.26 86.36,3.46 85.44,2.54 59.34,2.54 58.42,3.46 58.42,62.58 59.34,63.5 112.11,63.5 113.03,62.58 113.03,48.26
  pour Bottom (isolate 0.254): 87.63,48.26 113.03,48.26 113.03,2.54 87.63,2.54
GND1  (via drill 0.5, 0.7, 1.3)
  Top 0.254: R2.1 v13.97,38.86 | LED1.C v2.54,52.07 | U4.3 14.73,4.83 | R22.2 24.98,42.76 v24.89,42.67
  Top 0.406: C11.2 v2.79,47.75
  Top 1.27: C14.- v20.32,49.02 | C6.- v20.32,13.72
  pour Bottom (isolate 0.61, rank 2, no thermals): 1.27,2.54 54.96,2.54 55.88,3.46 55.88,62.58 54.96,63.5 1.27,63.5
  pour Top (isolate 0.61): 11.43,2.54 54.96,2.54 55.88,3.46 55.88,30.83 54.96,31.75 11.43,31.75 11.43,29.21
I24_MEA  (via drill 0.38)
  Top 0.254: 102.36,37.34 D4.3 | D4.3 102.27,37.25 102.36,37.34 | D4.3 102.45,37.34 | D4.3 104.06,37.25 v104.14,37.34 | v111.76,18.8 112.52,19.56 112.52,36.32 111.76,37.08 v111,37.08 | U1.24 105.16,18.55 v105.41,18.8 | C12.1 101.69,38.01 102.36,37.34
  Bottom 0.254: v111.76,18.8 v105.41,18.8 | v111,37.08 110.74,37.34 v104.14,37.34
MISO  (via drill 0.38)
  Top 0.254: U1.16 v102.37,12.95 v102.36,12.95
  Bottom 0.254: J1.1 105.41,9.91 v102.36,12.95
MOSI
  Top 0.254: J1.4 101.6,6.6 101.6,11.42 U1.15
N$1
  Top 0.25: U4.1 25.65,2.29 R1.2
N$2
  Top 0.254: U3.6 103.5,41.44 C4.1
N$3  (via drill 0.38)
  Top 0.254: U8.4 97.09,34.86 98.04,35.81 98.55,35.81 99.31,35.05 v99.82,35.05 | R4.2 101.6,27.18 v101.6,28.7 101.77,28.87 R3.1
  Bottom 0.254: v99.82,35.05 101.09,35.05 101.6,34.54 v101.6,28.7
N$4
  Top 1.93: C1.- C6.+
N$5
  Top 0.254: D1.A 12.45,34.8 11.68,35.56 8.51,35.56 Q1.1 8.38,35.43 8.38,36.58 10.41,36.58 10.83,37 R2.2
N$6
  Top 0.254: Q3.E 16.51,25.25 16.51,33.53
  pour Top (isolate 0.61, rank 2): 1.27,63.5 54.96,63.5 55.88,62.58 55.88,33.94 54.96,33.02 1.27,33.02
  pour Top (isolate 0.61, no thermals): 1.27,43.94 10.16,43.94 9.91,33.02 1.27,33.02
N$7
  Top 0.254: 99.82,54.36 LED2.A
  Top 0.406: 99.56,56.99 R9.1 99.82,54.36
N$8
  Top 0.254: U9.4 97.09,28.04 R5.2 98.04,27.18 98.13,27.09 99.65,27.09 R4.1
N$9
  Top 0.254: R8.1 3.3,54.1 2.54,54.86 LED1.A
N$10
  Top 0.254: R6.2 LED4.A
N$11
  Top 0.254: R7.2 LED3.A
N$12
  Top 0.254: U8.1 95.06,36.76 96.01,35.81 97.28,35.81 97.79,36.32 99.82,36.32 101.6,34.54 R6.1
N$13
  Top 0.254: U9.1 103.77,33.3 R7.1
N$14  (via drill 0.38)
  Top 0.254: R13.1 R12.2 95.59,45.81 v94.74,44.96 | U5.4 93.5,39.85 v93.47,39.88
  Bottom 0.254: v94.74,44.96 93.73,43.94 93.73,40.13 v93.47,39.88
N$15
  Top 0.254: 93.98,43.94 94.55,43.37 U5.3 | 93.98,43.94 R11.2 93.22,43.94 | R10.1 93.47,44.45 93.98,43.94
N$16
  Top 0.254: U1.18 103.89,13.72 FB1.2 106.43,13.72
N$17
  Top 0.254: D4.1 103.39,39.54 R14.2 R25.1
N$18
  Top 0.254: U3.7 104.78,41.36 R14.1
N$19
  Top 0.254: U2.P7 85.6,37.34 85.6,48.26 86.11,48.77 87.38,48.77 87.96,48.19 R21.2
N$20
  Top 0.254: LED7.C R16.2
N$21
  Top 0.254: R18.2 LED5.C
N$22
  Top 0.254: R17.2 LED6.C
N$23
  Top 0.25: R23.1 13.22,2.71 U4.4
N$24
  Top 0.25: 11.18,18.02 11.94,18.78
  Top 0.254: 11.94,18.78 Q3.B | 11.18,18.02 11.18,5.33 10.54,4.7 10.25,4.41 | 10.25,4.41 10.16,4.32 | R23.2 10.25,4.41
N$25
  Top 0.254: LED8.C R24.2
RST  (via drill 0.38)
  Top 0.254: R15.1 94.65,3.81 S1.3 S1.4 94.58,8.89 C15.1 94.74,9.14 95.5,9.91 v98.04,9.91 J1.5 | U1.29 99.17,18.65 v98.55,18.03
  Bottom 0.254: v98.55,18.03 98.04,17.53 v98.04,9.91
SCK
  Top 0.254: J1.3 102.87,9.91 103.86,10.9 U1.17
SCL
  Top 0.254: U1.28 99.97,21.86 R19.1 100.16,23.37 102.36,23.37 104.9,25.91 106.43,25.91 107.68,24.65 P1.2
SDA
  Top 0.254: U1.27 100.77,21.94 R20.1 102.27,22.52 104.39,24.64 105.66,24.64 P1.1
TEMP
  Top 0.254: U7.3 92.23,31.78 | U7.3 92.27,33.59 93.54,34.86 U8.3 94.2,34.07 94.97,33.3 U9.3 | U6.2 92.11,31.94 U7.3
TEMP_OUT  (via drill 0.38)
  Top 0.254: U7.1 94.17,31.18 93.47,30.48 92.71,30.48 92.27,30.04 U7.4 92.27,27.37 92.71,26.92 v95,26.92 | U1.26 101.57,19.02 101.09,18.54 v100.33,18.54
  Bottom 0.254: v100.33,18.54 98.3,20.57 98.3,25.65 97.03,26.92 v95,26.92
TEST1
  Top 0.254: U1.30 98.37,24.57 97.03,25.91 LED6.A
TEST2
  Top 0.254: U1.31 97.57,23.08 96.52,24.13 LED5.A
TEST3
  Top 0.254: U1.32 96.77,21.6 96.01,22.35 LED7.A
V24_MEA  (via drill 0.38)
  Top 0.254: U5.1 96.45,42.86 97.7,44.11 R13.2 98.64,44.11 99.06,43.69 v99.06,43.43 | v111.76,17.53 113.03,18.8 113.03,36.83 111.51,38.35 v110.24,38.35 | U1.23 105.19,17.75 v105.41,17.53
  Bottom 0.254: v99.06,43.43 98.81,43.43 98.04,42.67 98.04,39.12 98.81,38.35 v110.24,38.35 | v111.76,17.53 v105.41,17.53
V+
  Top 0.254: R21.1 90.68,35.05 89.41,36.32 89.41,37.85 88.65,38.61 88.65,47.24 89.15,47.75
  pour Top (isolate 0.61): 103.63,47.5 103.63,50.29 100.58,53.34 100.58,62.58 99.67,63.5 59.34,63.5 58.42,62.58 58.42,3.46 59.34,2.54 85.44,2.54 86.36,3.46 86.36,47.5
  pour Top (isolate 0.406, no thermals): 101.6,47.5 101.6,50.29 103.63,50.29 103.63,47.5
  pour Top (isolate 0.406, no thermals): 92.46,47.5 92.46,48.77 94.49,48.77 94.49,47.5
VCC
  pour Top (isolate 0.61, no thermals): 10.16,30.73 10.16,8.54 9.24,7.62 2.19,7.62 1.27,8.54 1.27,30.73

### Text on the board
tPlace: GND | +24V | +48V | AUX | Purdue University | +Vin | +Vo | DC/DC Module Mk.2 | ROV x4 | Remote | +Sen | Overtemp | Trim | Warning | -Sen | PWR GOOD | Case | I_WARN | TEST | COMM | +48VIN | -Vin | -Vo | +5V | RTN